# EAGLE design Carte-Puissance (EAGLE 9.6.2)
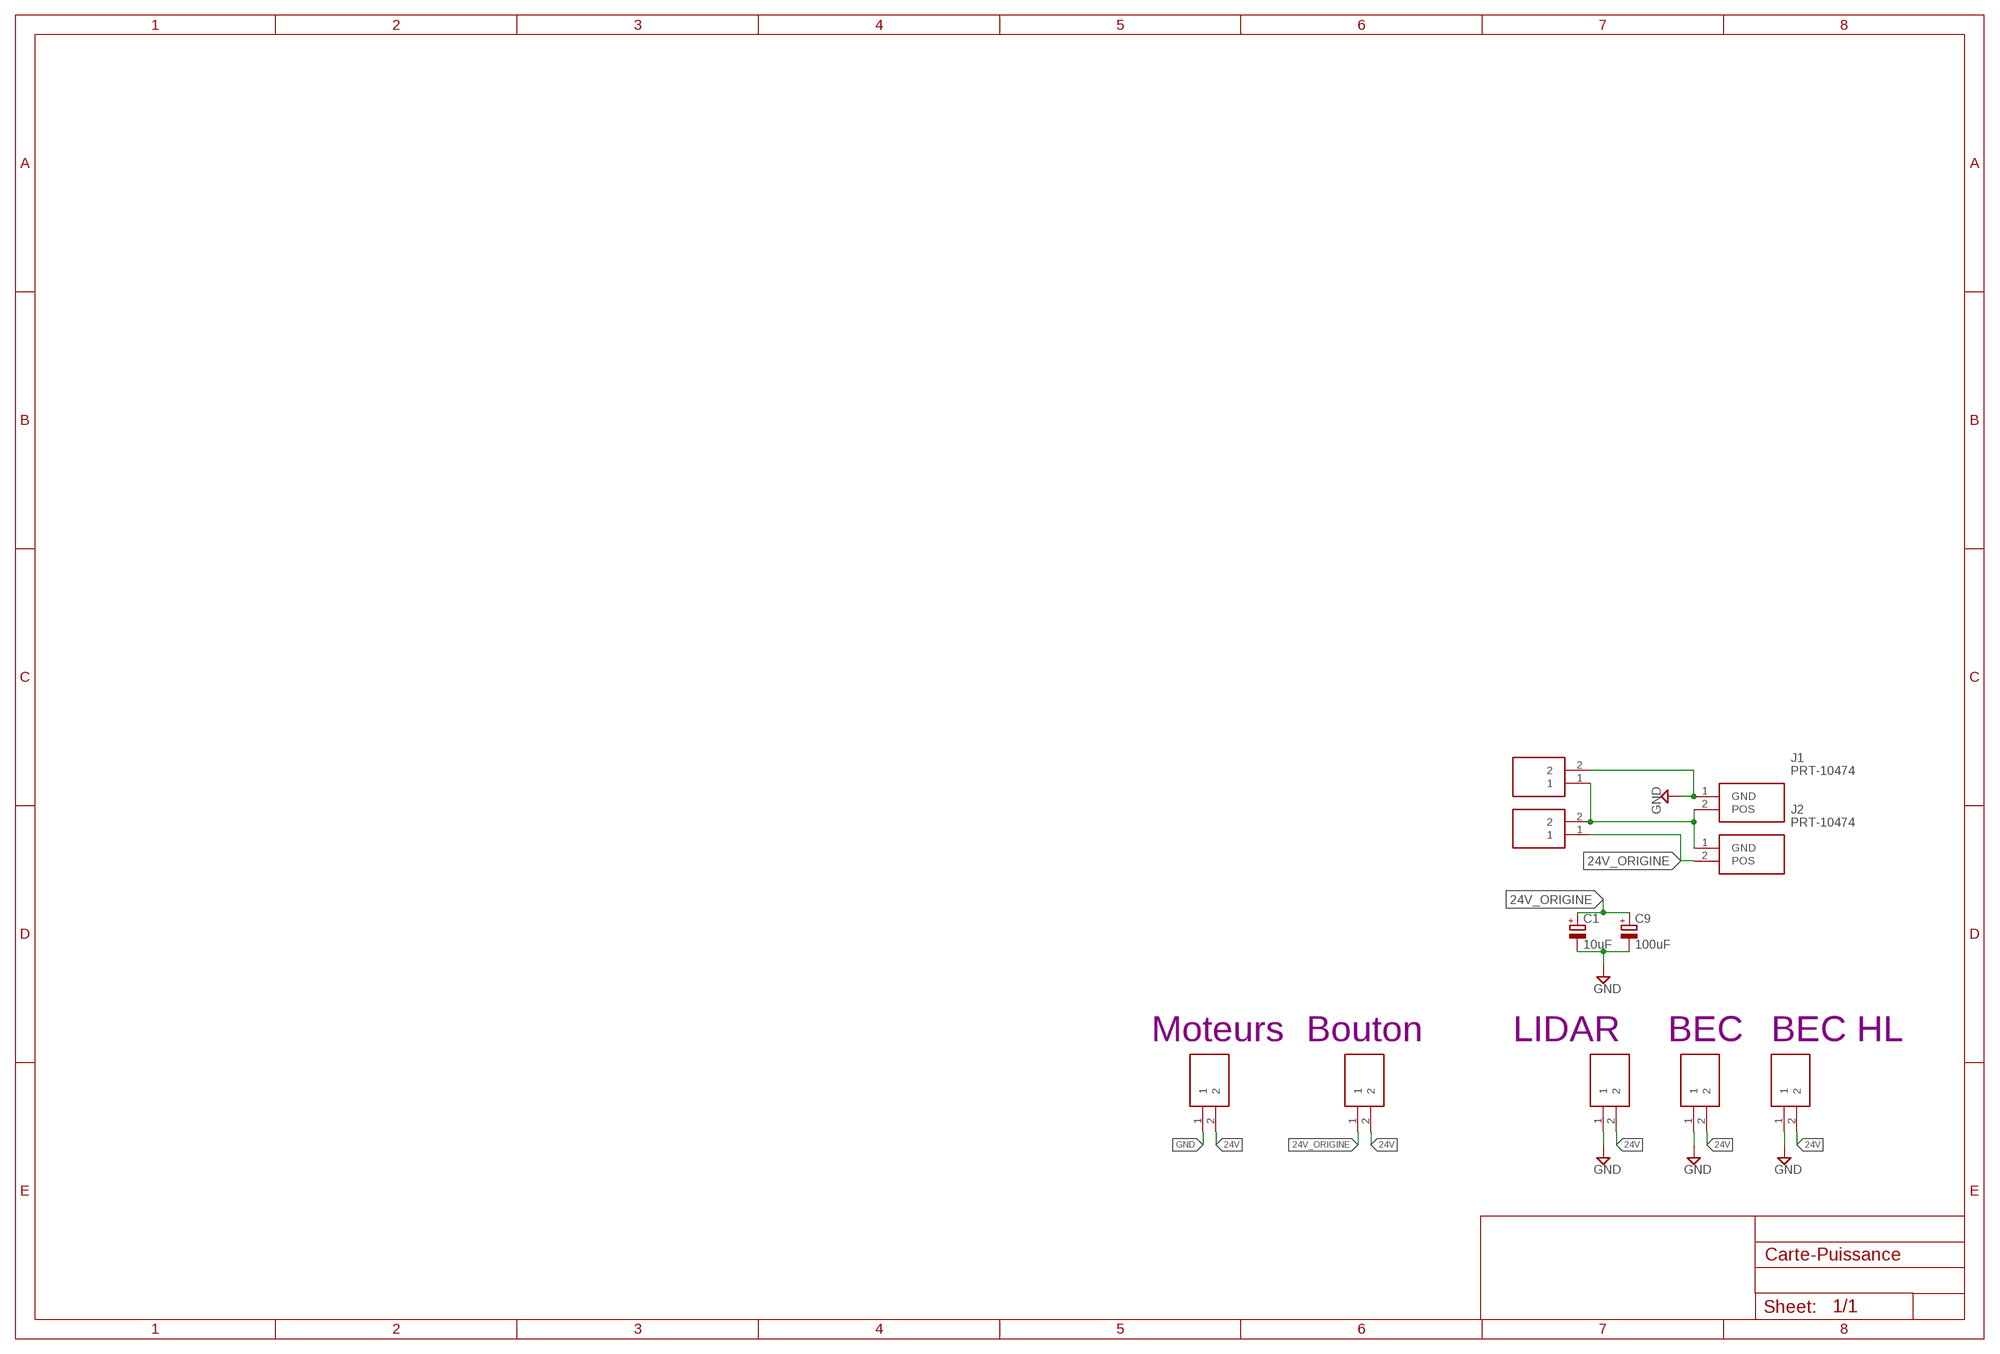
[diagram p0: schematic, sheet 1]

## Parts
C1  10uF  CPOL-EU150CLZ-0810  [150CLZ-0810]
C9  100uF  CPOL-EU150CLZ-0810  [150CLZ-0810]
J1  PRT-10474  [SHDR2W320P716_1X2_1574X813X158]
J2  PRT-10474  [SHDR2W320P716_1X2_1574X813X158]
J3  B2P-VH(LF)(SN)  [SHDR2W114P0X396_1X2_786X850X94]
J4  B2P-VH(LF)(SN)  [SHDR2W114P0X396_1X2_786X850X94]
J5  B2P-VH(LF)(SN)  [SHDR2W114P0X396_1X2_786X850X94]
J6  B2P-VH(LF)(SN)  [SHDR2W114P0X396_1X2_786X850X94]
J7  B2P-VH(LF)(SN)  [SHDR2W114P0X396_1X2_786X850X94]
J8  B2P-VH(LF)(SN)  [SHDR2W114P0X396_1X2_786X850X94]
J9  B2P-VH(LF)(SN)  [SHDR2W114P0X396_1X2_786X850X94]

## Nets
24V: J3.2 J4.2 J5.2 J6.2 J7.2
24V_ORIGINE: C1.+ C9.+ J2.2(POS) J6.1 J8.1
GND: C1.- C9.- J1.1(GND) J3.1 J4.1 J5.1 J7.1 J9.2
N$1: J1.2(POS) J2.1(GND) J8.2 J9.1

## Notes on the sheet
- Moteurs | Bouton | LIDAR | BEC | BEC HL

## Library data of the parts
C1 C9 = INTech:CPOL-EU: POLARIZED CAPACITOR, European symbol; SPICEPREFIX: C
J1 J2 = INTech:PRT-10474: Soldering Workstation Equipment XT60 Connectors Male/Female Pair Source: Datasheet <http://cdn.sparkfun.com/datasheets/Prototyping/xt60.pdf>; DESCRIPTION: Soldering Workstation Equipment XT60 Connectors Male/Female Pair; HEIGHT: 15.875mm; MANUFACTURER_NAME: SparkFun; MANUFACTURER_PART_NUMBER: PRT-10474; MOUSER_PART_NUMBER: 474-PRT-10474; MOUSER_PRICE-STOCK: https://www.mouser.com/Search/Refine.aspx?Keyword=474-PRT-10474
J3-J9 = INTech:B2P-VH(LF)(SN): connector,multipole PCB use,B2P-VH,VH se JST VH Series, 3.96mm Pitch 2 Way 1 Row Straight PCB Header, Solder Termination, 10A Source: Datasheet <http://www.jst-mfg.com/product/pdf/eng/eVH.pdf>; DESCRIPTION: connector,multipole PCB use,B2P-VH,VH se JST VH Series, 3.96mm Pitch 2 Way 1 Row Straight PCB Header, Solder Termination, 10A; HEIGHT: 9.4mm; MANUFACTURER_NAME: JST (JAPAN SOLDERLESS TERMINALS); MANUFACTURER_PART_NUMBER: B2P-VH(LF)(SN); RS_PART_NUMBER: 8201147P; RS_PRICE-STOCK: http://uk.rs-online.com/web/p/products/8201147P

## Board
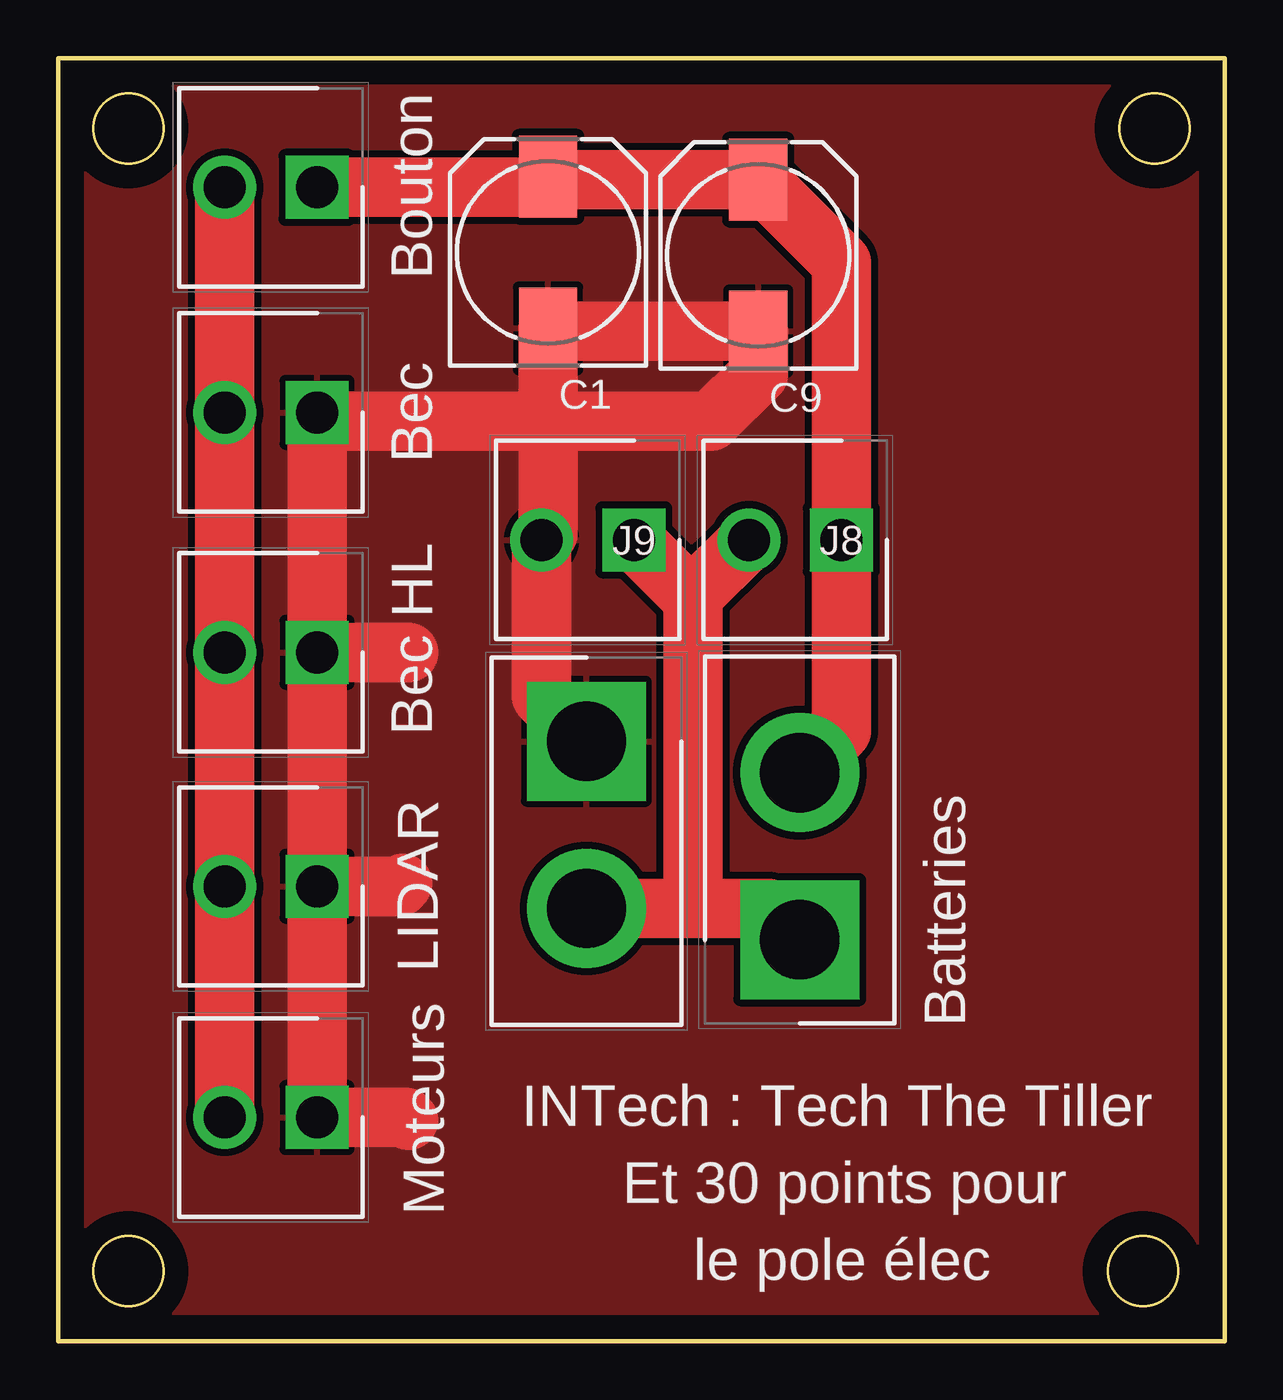
[diagram p1: board, top side]
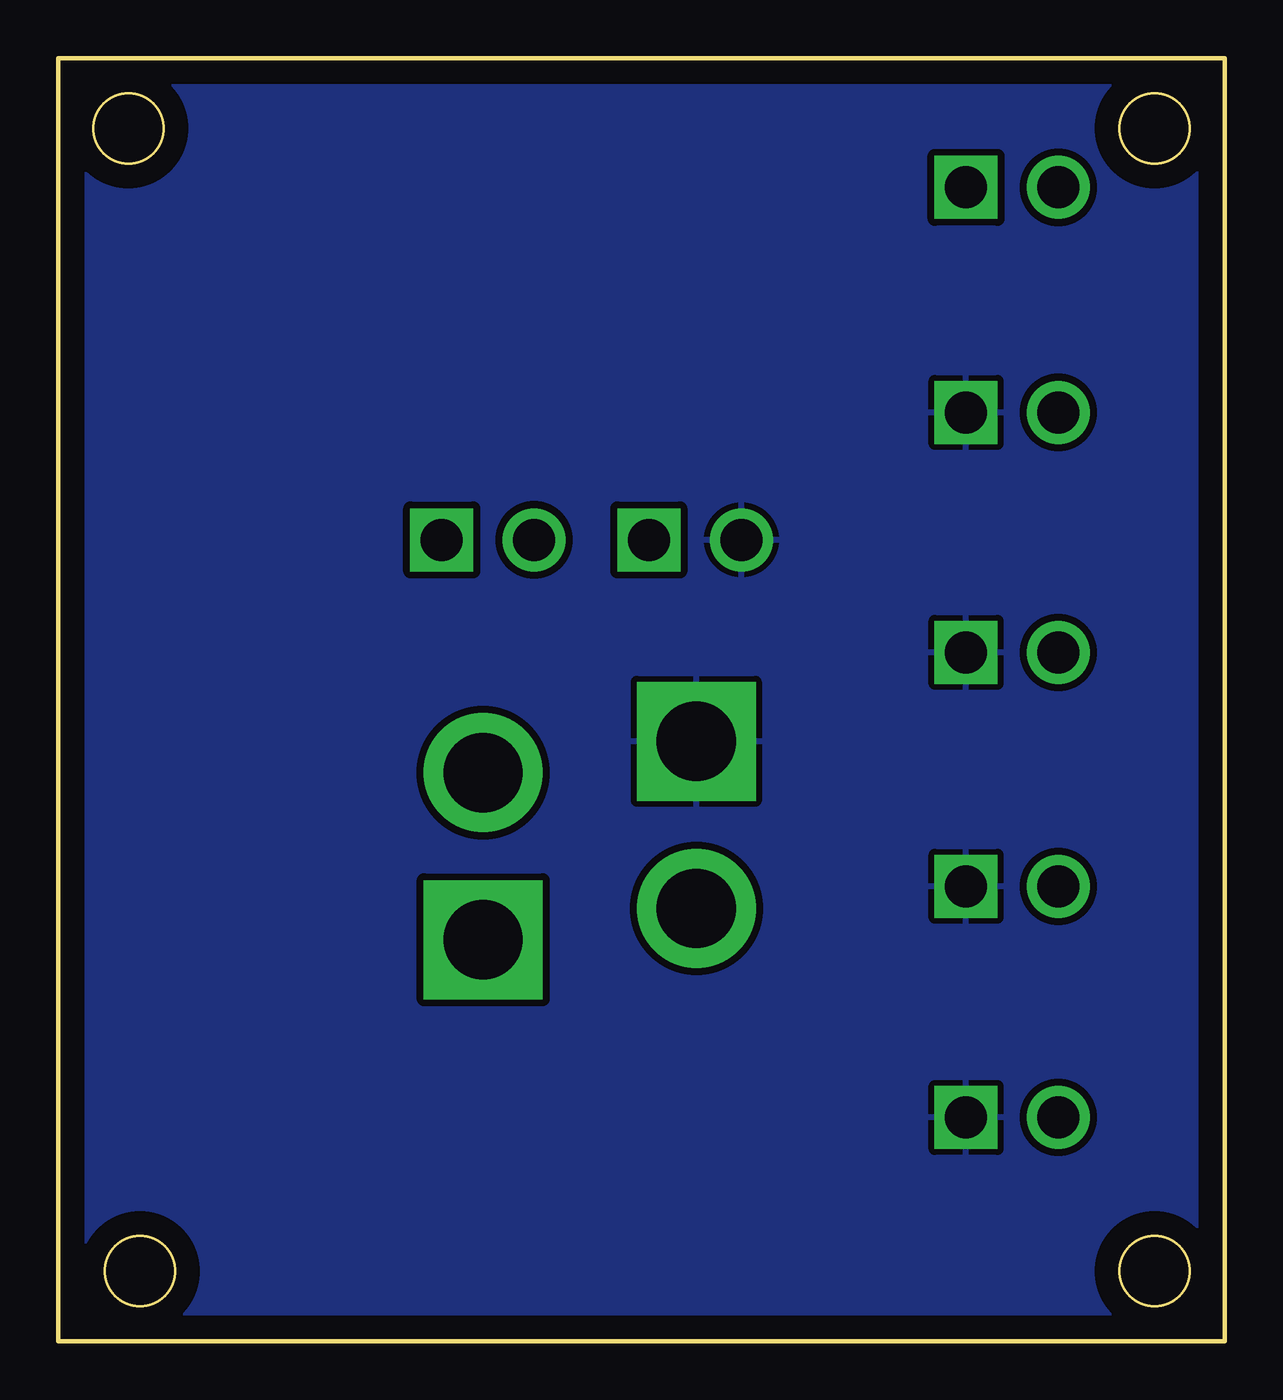
[diagram p2: board, bottom side, seen from below]

Size 50 x 55 mm. Coordinates in mm from the lower left corner, seen from the top.
Outline: 0,55 50,55 50,0 0,0 0,55
Outline: circle at 3,3 radius 1.5
Outline: circle at 46.5,3 radius 1.5
Outline: circle at 47,52 radius 1.5
Outline: circle at 3,52 radius 1.5
Copper layers (1*16): Top 0.035mm / dielectric 1.5mm / Bottom 0.035mm
Design rules "default *": minimum track width 6mil, minimum drill 0.35mm, track to track 12mil, track to pad 12mil, pad to pad 12mil, via to via 12mil, smd to smd 12mil, copper to edge 40mil, drill to drill 6mil, minimum pad ring 10mil, minimum via ring 8mil, stop-mask expansion 4mil, vias tented up to drill 0mil, thermal gap 10mil

### Footprints (pad centres in the part's own frame; a part is rotated, then mirrored left to right if it is on the bottom)
150CLZ-0810 = smd 3.5 x 2.5: + 3.25,0; - -3.25,0
SHDR2W320P716_1X2_1574X813X158 = drill 3.4 pad 5.1 square: 1 0,0 | drill 3.4 pad 5.1: 2 7.163,0
SHDR2W114P0X396_1X2_786X850X94 = drill 1.8 pad 2.7 square: 1 0,0 | drill 1.8 pad 2.7: 2 3.96,0

### Placement (x,y rotation side)
C1  20.99,46.67 90 top
C9  30.01,46.55 90 top
J1  22.64,25.72 270 top
J2  31.79,17.21 90 top
J3  11.09,29.53 180 top
J4  11.09,39.82 180 top
J5  11.09,19.5 180 top
J6  11.09,49.47 180 top
J7  11.09,9.59 180 top
J8  33.57,34.36 180 top
J9  24.68,34.36 180 top

### Tracks (layer width: path | path; a pad name or v marks a point on that pad's centre or on a via)
24V
  Top 2.54: J6.2 J4.2 J3.2 J5.2 J7.2
24V_ORIGINE
  Top 2.54: C1.+ | J2.2 33.57,26.15 J8.1 33.57,46.24 C9.+ 21.12,49.8 C1.+ | C1.+ 20.54,49.47 J6.1
GND
  Top 2.54: J3.1 J4.1 11.47,39.44 27.98,39.44 30.01,41.47 C9.- 21.12,43.3 C1.- 20.99,34.63 J9.2 20.72,27.65 J1.1 | J3.1 J5.1 | J5.1 J7.1 14.9,9.59 15.02,9.46 | J3.1 15.02,29.53 | J5.1 14.64,19.5 14.77,19.62
  pour Bottom: 0.4,57.35 50.02,57.35 52.99,54.38 52.99,0 50.55,-2.44 0.2,-2.44 -1.3,-0.95 -1.3,55.65
  pour Top: 0.29,57.22 50.08,57.22 53.12,54.17 53.12,-0.19 50.84,-2.47 0.29,-2.47 -1.23,-0.95 -1.23,55.69
N$1
  Top 2.54: J1.2 27.22,18.56 | 27.22,18.56 30.44,18.56 J2.1 | J8.2 27.22,31.97 | 27.22,18.56 27.22,31.97 | 27.22,31.97 27.07,31.97 J9.1

### Text on the board
tPlace: Bouton | Bec | Bec HL | Batteries | LIDAR | INTech : Tech The Tiller | Et 30 points pour | Moteurs | le pole élec
tValues: Son